# Altium project UniversalFullBridge.PrjPcb
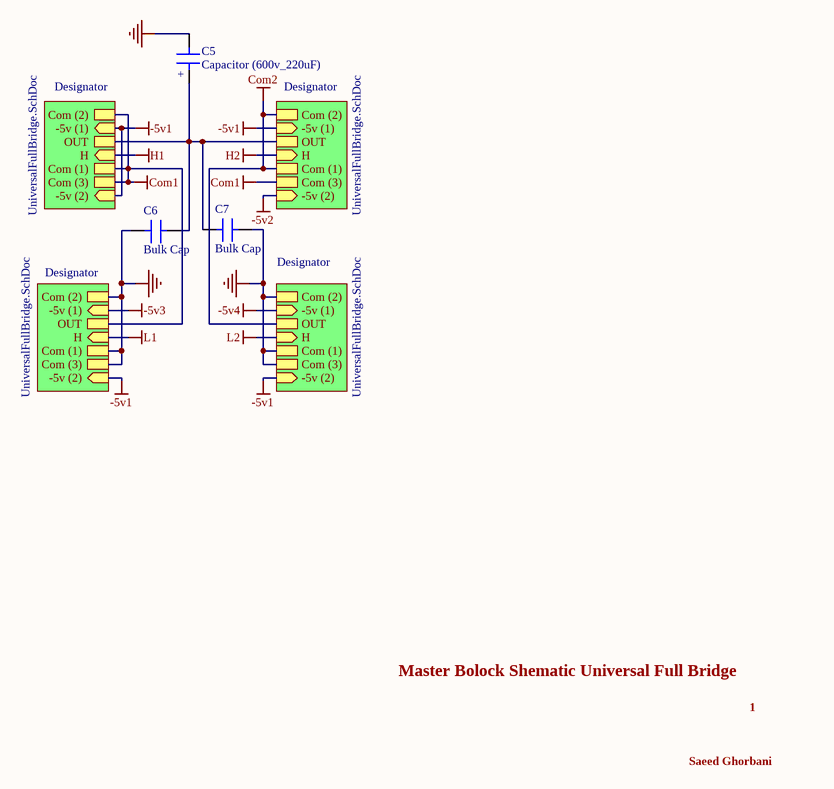
[diagram p0: MasterShematic.SchDoc]
2 sheets, 63 parts. Net scope: hierarchical (ports join the sheet entries above them; power ports are global).
Board file: UniversalFullBridge.PcbDoc
Sheets:
  MasterShematic.SchDoc
    Designator = UniversalFullBridge.SchDoc
    Designator = UniversalFullBridge.SchDoc
    Designator = UniversalFullBridge.SchDoc
    Designator = UniversalFullBridge.SchDoc

## Sheet MasterShematic.SchDoc
size A

### Parts
C5  Capacitor (600v_220uF)
C6  Bulk Cap
C7  Bulk Cap

### Sub-sheets
Designator = UniversalFullBridge.SchDoc: Com (2), -5v (1) (in), OUT, H (in), Com (1), Com (3), -5v (2) (in)
Designator = UniversalFullBridge.SchDoc: Com (2), -5v (1) (in), OUT, H (in), Com (1), Com (3), -5v (2) (in)
Designator = UniversalFullBridge.SchDoc: Com (2), -5v (1) (in), OUT, H (in), Com (1), Com (3), -5v (2) (in)
Designator = UniversalFullBridge.SchDoc: Com (2), -5v (1) (in), OUT, H (in), Com (1), Com (3), -5v (2) (in)

### Nets
-5v1: sheet Designator/-5v (1), sheet Designator/-5v (2), sheet Designator/-5v (1), sheet Designator/-5v (2), sheet Designator/-5v (2)
Com1: sheet Designator/Com (2), sheet Designator/Com (1), sheet Designator/Com (3), sheet Designator/Com (3), sheet Designator/OUT
Com2: sheet Designator/Com (2), sheet Designator/Com (1), sheet Designator/OUT
GND: C5.2 C6.2 C7.1 ; sheet Designator/Com (2), sheet Designator/Com (1), sheet Designator/Com (3), sheet Designator/Com (2), sheet Designator/Com (1), sheet Designator/Com (3)
NetC5_1: C5.1 C6.1 C7.2 ; sheet Designator/OUT, sheet Designator/OUT

### Notes on the sheet
- Master Bolock Shematic Universal Full Bridge
- 1
- Saeed Ghorbani
- (in symbol Capacitor (600v_220uF)) +

### Library data of the parts
C6 C7 = Capcitor (3300pF Bulk)

## Sheet UniversalFullBridge.SchDoc
size A
Used 4 times, as channels Designator, Designator, Designator, Designator. Parts and nets are listed once, with the designators drawn on the sheet.
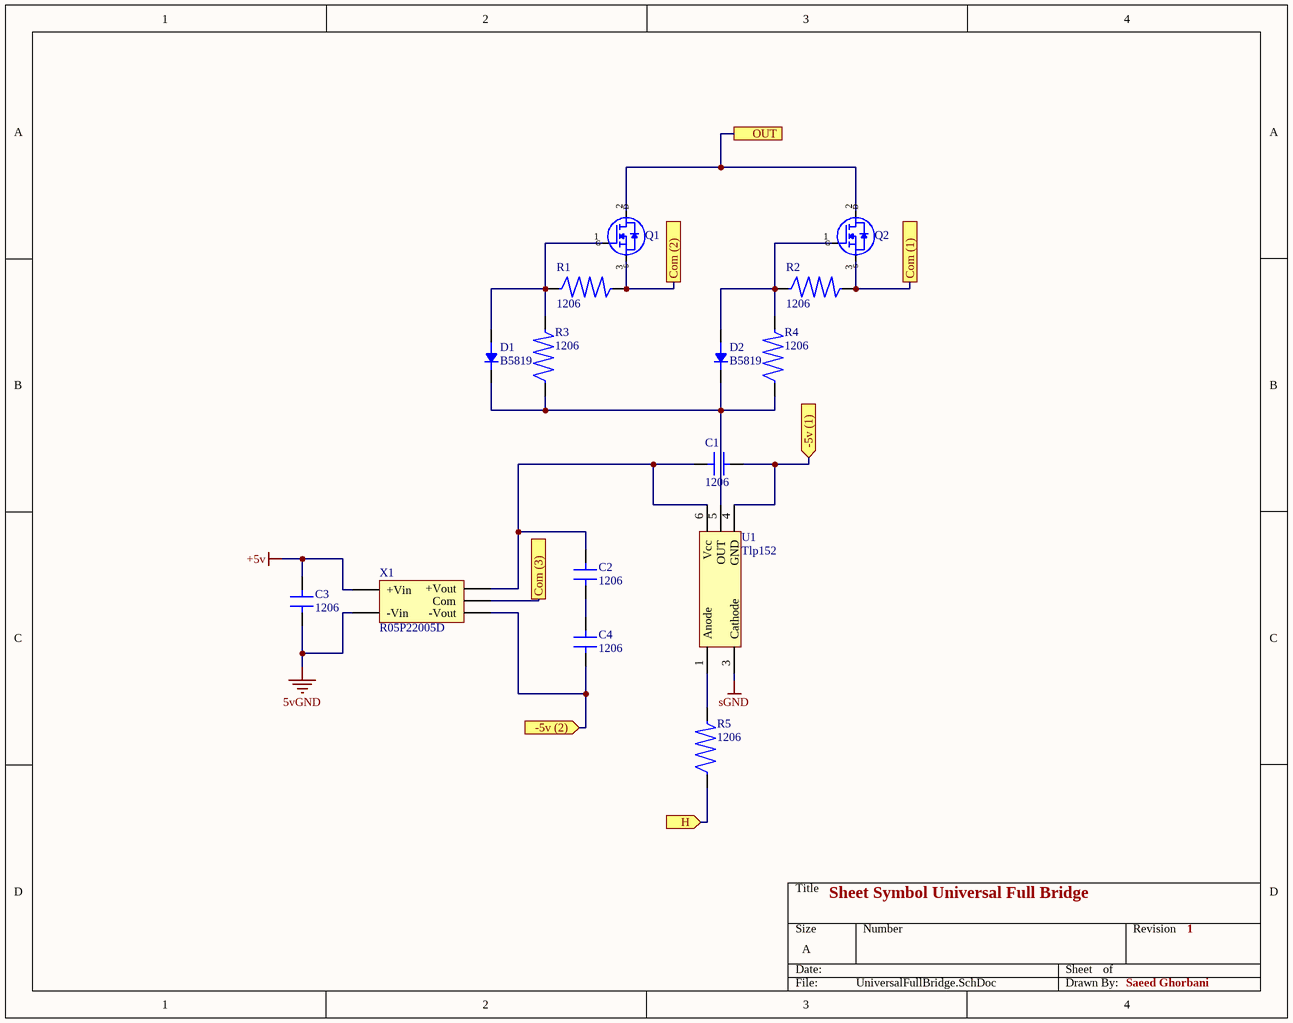
[diagram p1: UniversalFullBridge.SchDoc]

### Parts
C1  1206
C2  1206
C3  1206
C4  1206
D1  B5819
D2  B5819
Q1  To263 Mosfet  (value not drawn)
Q2  To263 Mosfet  (value not drawn)
R1  1206
R2  1206
R3  1206
R4  1206
R5  1206
U1  Tlp152
X1  R05P22005D

### Ports
-5v (1) (in), -5v (2) (in), Com (1), Com (2), Com (3), H (in), OUT

### Nets
5vGND: C3.1 X1.2(-Vin)
+5v: C3.2 X1.1(+Vin)
sGND: U1.3(Cathode)
-5v (1): C1.2 U1.4(GND) ; port -5v (1)
-5v (2): C4.1 X1.5(-Vout) ; port -5v (2)
Com (1): Q2.3(S) R2.2 ; port Com (1)
Com (2): Q1.3(S) R1.2 ; port Com (2)
Com (3): X1.6(Com) ; port Com (3)
H: R5.1 ; port H
OUT: Q1.2(D) Q2.2(D) ; port OUT
NetC1_1: C1.1 C2.2 U1.6(Vcc) X1.7(+Vout)
NetC2_1: C2.1 C4.2
NetD1_1: D1.1(Anode) Q1.1(G) R1.1 R3.2
NetD1_2: D1.2(Cathode) D2.2(Cathode) R3.1 R4.1 U1.5(OUT)
NetD2_1: D2.1(Anode) Q2.1(G) R2.1 R4.2
NetR5_2: R5.2 U1.1(Anode)

### Channels
Designator: designators end in _Designator#1; ports -5v (1)=-5v1 -5v (2)=-5v1 Com (1)=Com1 Com (2)=Com1 Com (3)=Com1 H=H1 OUT=NetC5_1
Designator: designators end in _Designator#2; ports -5v (1)=-5v1 -5v (2)=-5v2 Com (1)=Com2 Com (2)=Com2 Com (3)=Com1 H=H2 OUT=NetC5_1
Designator: designators end in _Designator#3; ports -5v (1)=-5v3 -5v (2)=-5v1 Com (1)=GND Com (2)=GND Com (3)=GND H=L1 OUT=Com1
Designator: designators end in _Designator#4; ports -5v (1)=-5v4 -5v (2)=-5v1 Com (1)=GND Com (2)=GND Com (3)=GND H=L2 OUT=Com2

### Notes on the sheet
- Sheet Symbol Universal Full Bridge
- 1
- Saeed Ghorbani

### Library data of the parts
C1-C4 = Capcitor (1206)
D1 D2 = Diode
R1-R5 = Resistor (1206)
X1 = DC_DC Converter

## Nets that join several sheets
5vGND: Designator (C3_Designator#1.1 X1_Designator#1.2), Designator (C3_Designator#2.1 X1_Designator#2.2), Designator (C3_Designator#3.1 X1_Designator#3.2), Designator (C3_Designator#4.1 X1_Designator#4.2)
+5v: Designator (C3_Designator#1.2 X1_Designator#1.1), Designator (C3_Designator#2.2 X1_Designator#2.1), Designator (C3_Designator#3.2 X1_Designator#3.1), Designator (C3_Designator#4.2 X1_Designator#4.1)
-5v1: Designator (C1_Designator#1.2 C4_Designator#1.1 U1_Designator#1.4 X1_Designator#1.5), Designator (C1_Designator#2.2 U1_Designator#2.4), Designator (C4_Designator#3.1 X1_Designator#3.5), Designator (C4_Designator#4.1 X1_Designator#4.5)
Com1: Designator (5 pins), Designator (X1_Designator#2.6), Designator (Q1_Designator#3.2 Q2_Designator#3.2)
Com2: Designator (Q1_Designator#2.3 Q2_Designator#2.3 R1_Designator#2.2 R2_Designator#2.2), Designator (Q1_Designator#4.2 Q2_Designator#4.2)
GND: MasterShematic (C5.2 C6.2 C7.1), Designator (5 pins), Designator (5 pins)
sGND: Designator (U1_Designator#1.3), Designator (U1_Designator#2.3), Designator (U1_Designator#3.3), Designator (U1_Designator#4.3)
NetC5_1: MasterShematic (C5.1 C6.1 C7.2), Designator (Q1_Designator#1.2 Q2_Designator#1.2), Designator (Q1_Designator#2.2 Q2_Designator#2.2)